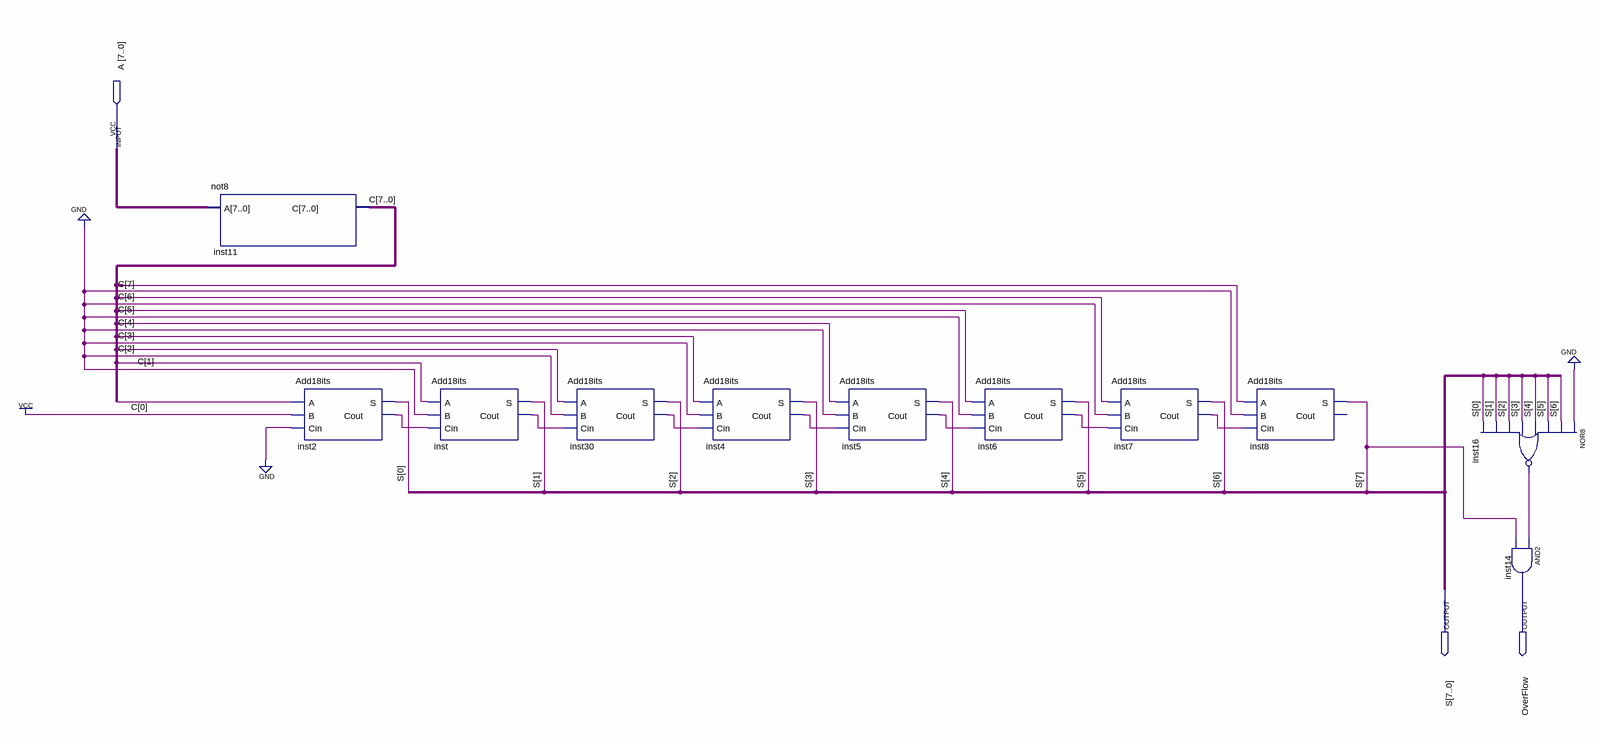
[diagram p0: schematic sheet]
// Quartus schematic Complemento2.bdf as structural Verilog: 11 symbols, 3 pins
module Complemento2 (
  input  [7:0] A,
  output [7:0] S,
  output OverFlow
);

  wire inst2_cout, inst4_cout, inst5_cout, inst6_cout, inst7_cout, inst16_out, inst30_cout, inst_cout;
  wire [7:0] C;

  not8 inst11 (.A(A), .C(C));
  Add18its inst2 (.A(C[0]), .B(1'b1), .Cin(1'b0), .S(S[0]), .Cout(inst2_cout));
  Add18its inst (.A(C[1]), .B(1'b0), .Cin(inst2_cout), .S(S[1]), .Cout(inst_cout));
  Add18its inst30 (.A(C[2]), .B(1'b0), .Cin(inst_cout), .S(S[2]), .Cout(inst30_cout));
  Add18its inst4 (.A(C[3]), .B(1'b0), .Cin(inst30_cout), .S(S[3]), .Cout(inst4_cout));
  Add18its inst5 (.A(C[4]), .B(1'b0), .Cin(inst4_cout), .S(S[4]), .Cout(inst5_cout));
  Add18its inst6 (.A(C[5]), .B(1'b0), .Cin(inst5_cout), .S(S[5]), .Cout(inst6_cout));
  Add18its inst7 (.A(C[6]), .B(1'b0), .Cin(inst6_cout), .S(S[6]), .Cout(inst7_cout));
  Add18its inst8 (.A(C[7]), .B(1'b0), .Cin(inst7_cout), .S(S[7]));  // open: Cout
  nor inst16 (inst16_out, 1'b0, S[6], S[5], S[4], S[3], S[2], S[1], S[0]);
  and inst14 (OverFlow, inst16_out, S[7]);
endmodule
